# EAGLE design signal-1btn (EAGLE 9.6.2)
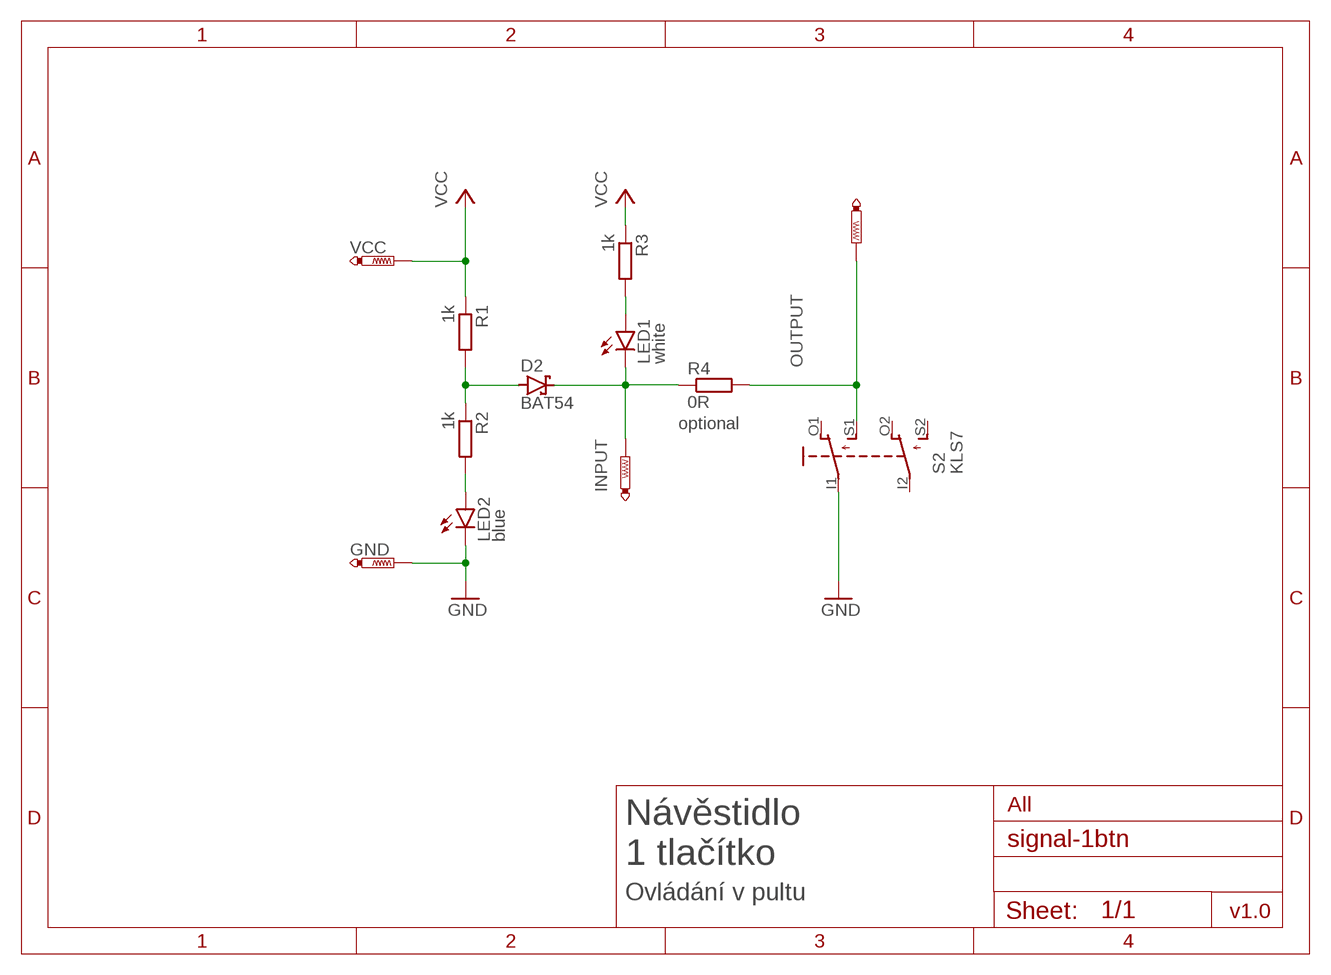
[diagram p0: schematic, sheet 1]

## Parts
D2  BAT54  [SOT23]
GND  PTR1PAD1-13Y  [P1-13Y]
LED1  white  LED3MM  [LED3MM]
LED2  blue  LED3MM  [LED3MM]
P_ACTIVE  PTR1PAD1-13Y  [P1-13Y]
P_ACTIVE1  PTR1PAD1-13Y  [P1-13Y]
R1  1k  R-EU_R0805  [R0805]
R2  1k  R-EU_R0805  [R0805]
R3  1k  R-EU_R0805  [R0805]
R4  0R  R-EU_R0805  [R0805]
S2  KLS7  [KLS7]
VCC  PTR1PAD1-13Y  [P1-13Y]

## Nets
GND: GND.TP LED2.K(C) S2.I1(P)
INPUT: D2.3(C) LED1.K(C) P_ACTIVE1.TP R4.1
N$1: LED2.A R2.2
N$3: D2.1(A) R1.2 R2.1
N$6: LED1.A R3.2
OUTPUT: P_ACTIVE.TP R4.2 S2.S1(S)
VCC: R1.1 R3.1 VCC.TP
Unconnected: S2.I2(P1) S2.O1(O) S2.O2(O1) S2.S2(S1)

## Notes on the sheet
- optional
- All
- Návěstidlo
  1 tlačítko
- Ovládání v pultu
- v1.0

## Library data of the parts
D2 = diode:BAT54: Schottky Diodes Source: Fairchild .. BAT54.pdf
GND P_ACTIVE P_ACTIVE1 VCC = testpad:PTR1: TEST PIN
LED1 LED2 = led:LED: LED OSRAM: - CHIPLED LG R971, LG N971, LY N971, LG Q971, LY Q971, LO R971, LY R971 LH N974, LH R974 LS Q976, LO Q976, LY Q976 LO Q996 - Hyper CHIPLED LW Q18S LB Q993, LB Q99A, LB R99A - SideLED LS A670, LO A670, LY A670, LG A670, LP A670 LB A673, LV A673, LT A673, LW A673 LH A674 LY A675 LS A676, LA A676, LO A676, LY A676, LW A676 LS A679, LY A679, LG A679 - Hyper Micro SIDELED® LS Y876, LA Y876, LO Y876, LY Y876 LT Y87S - SmartLED LW L88C, LW L88S LB L89C, LB L89S, LG L890 LS L89K, LO L89K, LY L89K LS L896, LA L896, LO L896, LY L896 - TOPLED LS T670, LO T670, LY T670, LG T670, LP T670 LSG T670, LSP T670, LSY T670, LOP T670, LYG T670 LG T671, LOG T671, LSG T671 LB T673, LV T673, LT T673, LW T673 LH T674 LS T676, LA T676, LO T676, LY T676, LB T676, LH T676, LSB T676, LW T676 LB T67C, LV T67C, LT T67C, LS T67K, LO T67K, LY T67K, LW E67C LS E67B, LA E67B, LO E67B, LY E67B, LB E67C, LV E67C, LT E67C LW T67C LS T679, LY T679, LG T679 LS T770, LO T770, LY T770, LG T770, LP T770 LB T773, LV T773, LT T773, LW T773 LH T774 LS E675, LA E675, LY E675, LS T675 LS T776, LA T776, LO T776, LY T776, LB T776 LHGB T686 LT T68C, LB T68C - Hyper Mini TOPLED® LB M676 - Mini TOPLED Santana® LG M470 LS M47K, LO M47K, LY M47K Source: http://www.osram.convergy.de LUXEON: - LUMILED® LXK2-PW12-R00, LXK2-PW12-S00, LXK2-PW14-U00, LXK2-PW14-V00 LXK2-PM12-R00, LXK2-PM12-S00, LXK2-PM14-U00 LXK2-PE12-Q00, LXK2-PE12-R00, LXK2-PE12-S00, LXK2-PE14-T00, LXK2-PE14-U00 LXK2-PB12-K00, LXK2-PB12-L00, LXK2-PB12-M00, LXK2-PB14-N00, LXK2-PB14-P00, LXK2-PB14-Q00 LXK2-PR12-L00, LXK2-PR12-M00, LXK2-PR14-Q00, LXK2-PR14-R00 LXK2-PD12-Q00, LXK2-PD12-R00, LXK2-PD12-S00 LXK2-PH12-R00, LXK2-PH12-S00 LXK2-PL12-P00, LXK2-PL12-Q00, LXK2-PL12-R00 Source: www.luxeon.com KINGBRIGHT: KA-3528ASYC Source: www.kingbright.com
R1-R4 = rcl:R-EU_: RESISTOR, European symbol; SPICEPREFIX: R
S2 = switch-mp:KLS7

## Net classes
1 PADS: clearance 0.8 mm to class 0

## Board
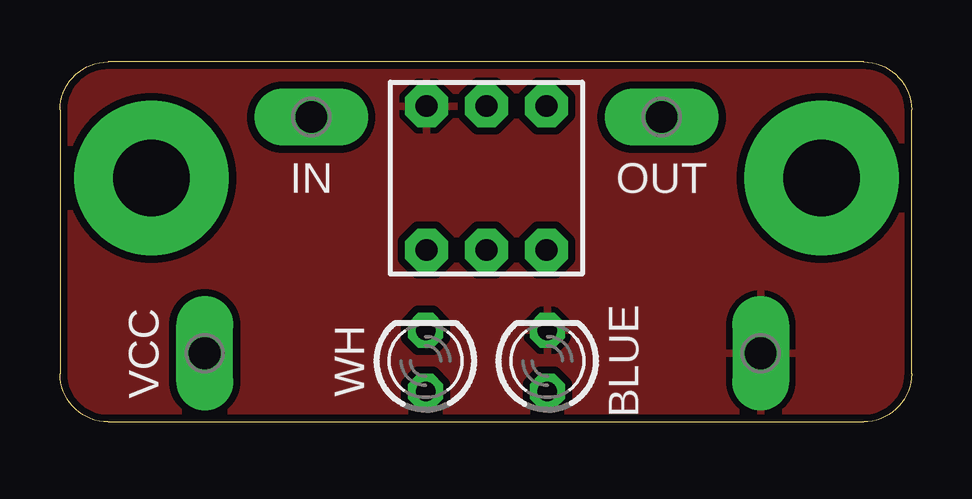
[diagram p1: board, top side]
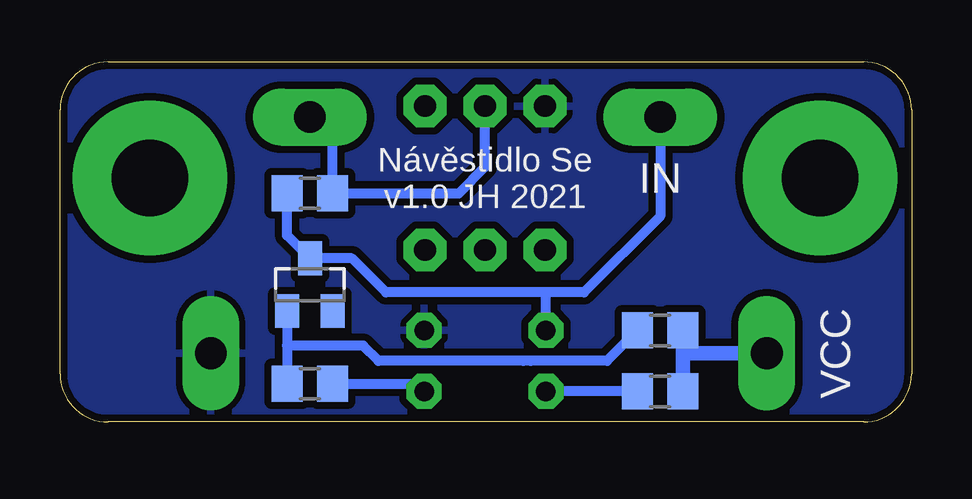
[diagram p2: board, bottom side, seen from below]

Size 35.5 x 15 mm. Coordinates in mm from the lower left corner, seen from the top.
Outline: 2,0 33.5,0 arc90 35.5,2 35.5,13 arc90 33.5,15 2,15 arc90 0,13 0,2 arc90 2,0
Copper layers (1*16): Top 0.035mm / dielectric 1.6mm / Bottom 0.035mm
Design rules "jlcpcb-2layers": minimum track width 5mil, minimum drill 0.3mm, track to track 5mil, track to pad 5mil, pad to pad 5mil, via to via 5mil, smd to smd 5mil, copper to edge 0.2mm, drill to drill 6mil, minimum pad ring 10mil, minimum via ring 3mil, stop-mask expansion 4mil, vias tented up to drill 0mil, thermal gap 10mil

### Footprints (pad centres in the part's own frame; a part is rotated, then mirrored left to right if it is on the bottom)
SOT23 = smd 1 x 1.4: 1 -0.95,-1.1; 2 0.95,-1.1; 3 0,1.1
P1-13Y = drill 1.321 pad 1.905 long: TP 0,0
LED3MM = drill 0.813 octagon: A -1.27,0; K 1.27,0
R0805 = smd 1.3 x 1.5: 1 -0.95,0; 2 0.95,0
KLS7 = drill 0.9 pad 1.778 octagon: I1 -2.5,3; I2 2.5,-3; O1 2.5,3; O2 -2.5,-3; S1 0,3; S2 0,-3

### Placement (x,y rotation side)
D2  25.08,5.71 0 bottom
GND  29.21,2.86 180 top
LED1  15.24,2.54 90 top
LED2  20.32,2.54 90 top
P_ACTIVE  25.08,12.7 90 top
P_ACTIVE1  10.48,12.7 90 top
R1  10.48,3.81 180 bottom
R2  25.08,1.59 0 bottom
R3  10.48,1.27 180 bottom
R4  25.08,9.53 0 bottom
S2  17.78,10.16 0 top
VCC  6.03,2.86 0 top

### Tracks (layer width: path | path; a pad name or v marks a point on that pad's centre or on a via)
GND
  pour Bottom (isolate 0.305): 0,0 0,15.24 35.56,15.24 35.56,0
  pour Top (isolate 0.305): 0,0 0,15.24 35.56,15.24 35.56,0
INPUT
  Bottom 0.406: R4.1 26.03,7.76 D2.3 23.32,6.82 21.91,5.4 15.24,5.4 | P_ACTIVE1.TP 10.48,8.57 13.65,5.4 15.24,5.4 | LED1.K 15.24,5.4
N$1
  Bottom 0.406: R2.2 20.64,1.59 LED2.A
N$3
  Bottom 0.406: R1.2 12.7,2.54 15.88,2.54 16.2,2.54 22.23,2.54 22.86,3.17 26.04,3.17 | D2.1 26.04,3.17 | R2.1 26.04,3.17
N$4  (via drill 3.2 pad 6.45)
  other vias: 3.81,10.16
N$5  (via drill 3.2 pad 6.45)
  other vias: 31.75,10.16
N$6
  Bottom 0.406: R3.2 LED1.A
OUTPUT
  Bottom 0.406: P_ACTIVE.TP 24.13,12.7 R4.2 18.88,9.53 17.78,10.62 S2.S1
VCC
  Bottom 0.61: VCC.TP 9.53,2.86 | 9.53,2.86 R1.1 | 9.53,2.86 9.53,2.85 R3.1

### Text on the board
tPlace: IN | OUT | VCC | WH | BLUE | ⏚
bPlace: IN | Návěstidlo Se / v1.0 JH 2021 | VCC | ⏚